# EAGLE schematic singleNode (EAGLE 9.0.1)
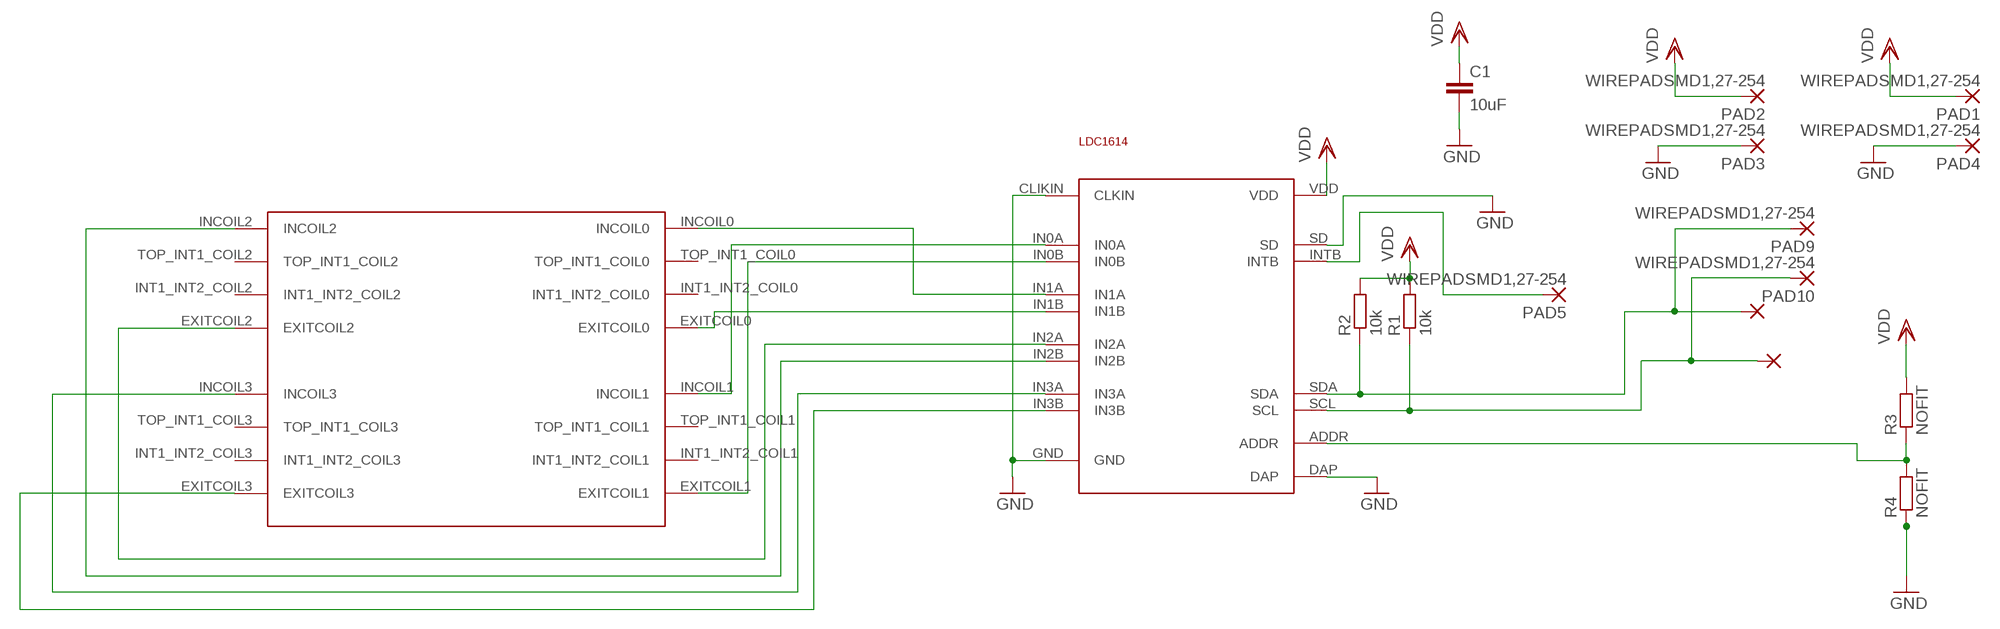
[diagram p0: schematic, sheet 1]

## Parts
C1  10uF  C-EUC0402  [C0402]
PAD1  WIREPADSMD1,27-254  [SMD1,27-2,54]
PAD2  WIREPADSMD1,27-254  [SMD1,27-2,54]
PAD3  WIREPADSMD1,27-254  [SMD1,27-2,54]
PAD4  WIREPADSMD1,27-254  [SMD1,27-2,54]
PAD5  WIREPADSMD1,27-254  [SMD1,27-2,54]
PAD6  WIREPADSMD1,27-254  [SMD1,27-2,54]
PAD7  WIREPADSMD1,27-254  [SMD1,27-2,54]
PAD9  WIREPADSMD1,27-254  [SMD1,27-2,54]
PAD10  WIREPADSMD1,27-254  [SMD1,27-2,54]
R1  10k  R-EU_R0402  [R0402]
R2  10k  R-EU_R0402  [R0402]
R3  NOFIT  R-EU_R0201  [R0201]
R4  NOFIT  R-EU_R0201  [R0201]
U1  LDC1614  [WQFN-16]
U$2  FATSQUARE_GROUP  [FAT_SQUARE]

## Nets
ADDR: R3.1 R4.2 U1.ADDR
GND: C1.2 PAD3.1(P) PAD4.1(P) R4.1 U1.CLIKIN(CLKIN) U1.DAP U1.GND U1.SD
INTRPT: PAD5.1(P) U1.INTB
N$6: U1.IN1A U$2.INCOIL0
N$7: U1.IN1B U$2.EXITCOIL0
N$8: U1.IN0A U$2.INCOIL1
N$9: U1.IN0B U$2.EXITCOIL1
N$10: U1.IN2A U$2.EXITCOIL2
N$11: U1.IN2B U$2.INCOIL2
N$12: U1.IN3A U$2.INCOIL3
N$13: U1.IN3B U$2.EXITCOIL3
SCL: PAD7.1(P) PAD10.1(P) R1.1 U1.SCL
SDA: PAD6.1(P) PAD9.1(P) R2.1 U1.SDA
VDD: C1.1 PAD1.1(P) PAD2.1(P) R1.2 R2.2 R3.2 U1.VDD
Unconnected: U$2.INT1_INT2_COIL0 U$2.INT1_INT2_COIL1 U$2.INT1_INT2_COIL2 U$2.INT1_INT2_COIL3 U$2.TOP_INT1_COIL0 U$2.TOP_INT1_COIL1 U$2.TOP_INT1_COIL2 U$2.TOP_INT1_COIL3

## Library data of the parts
C1 = resistor:C-EU: CAPACITOR, European symbol
PAD1-PAD7 PAD9 PAD10 = wirepad:WIREPAD: Wire PAD connect wire on PCB
R1-R4 = resistor:R-EU_: RESISTOR, European symbol
U1 = LDC1614:LDC1614
U$2 = coils:FATSQUARE_GROUP